# Altium schematic sheet 气压检测.SchDoc
size A2; SheetNumber: 1; SheetTotal: 1
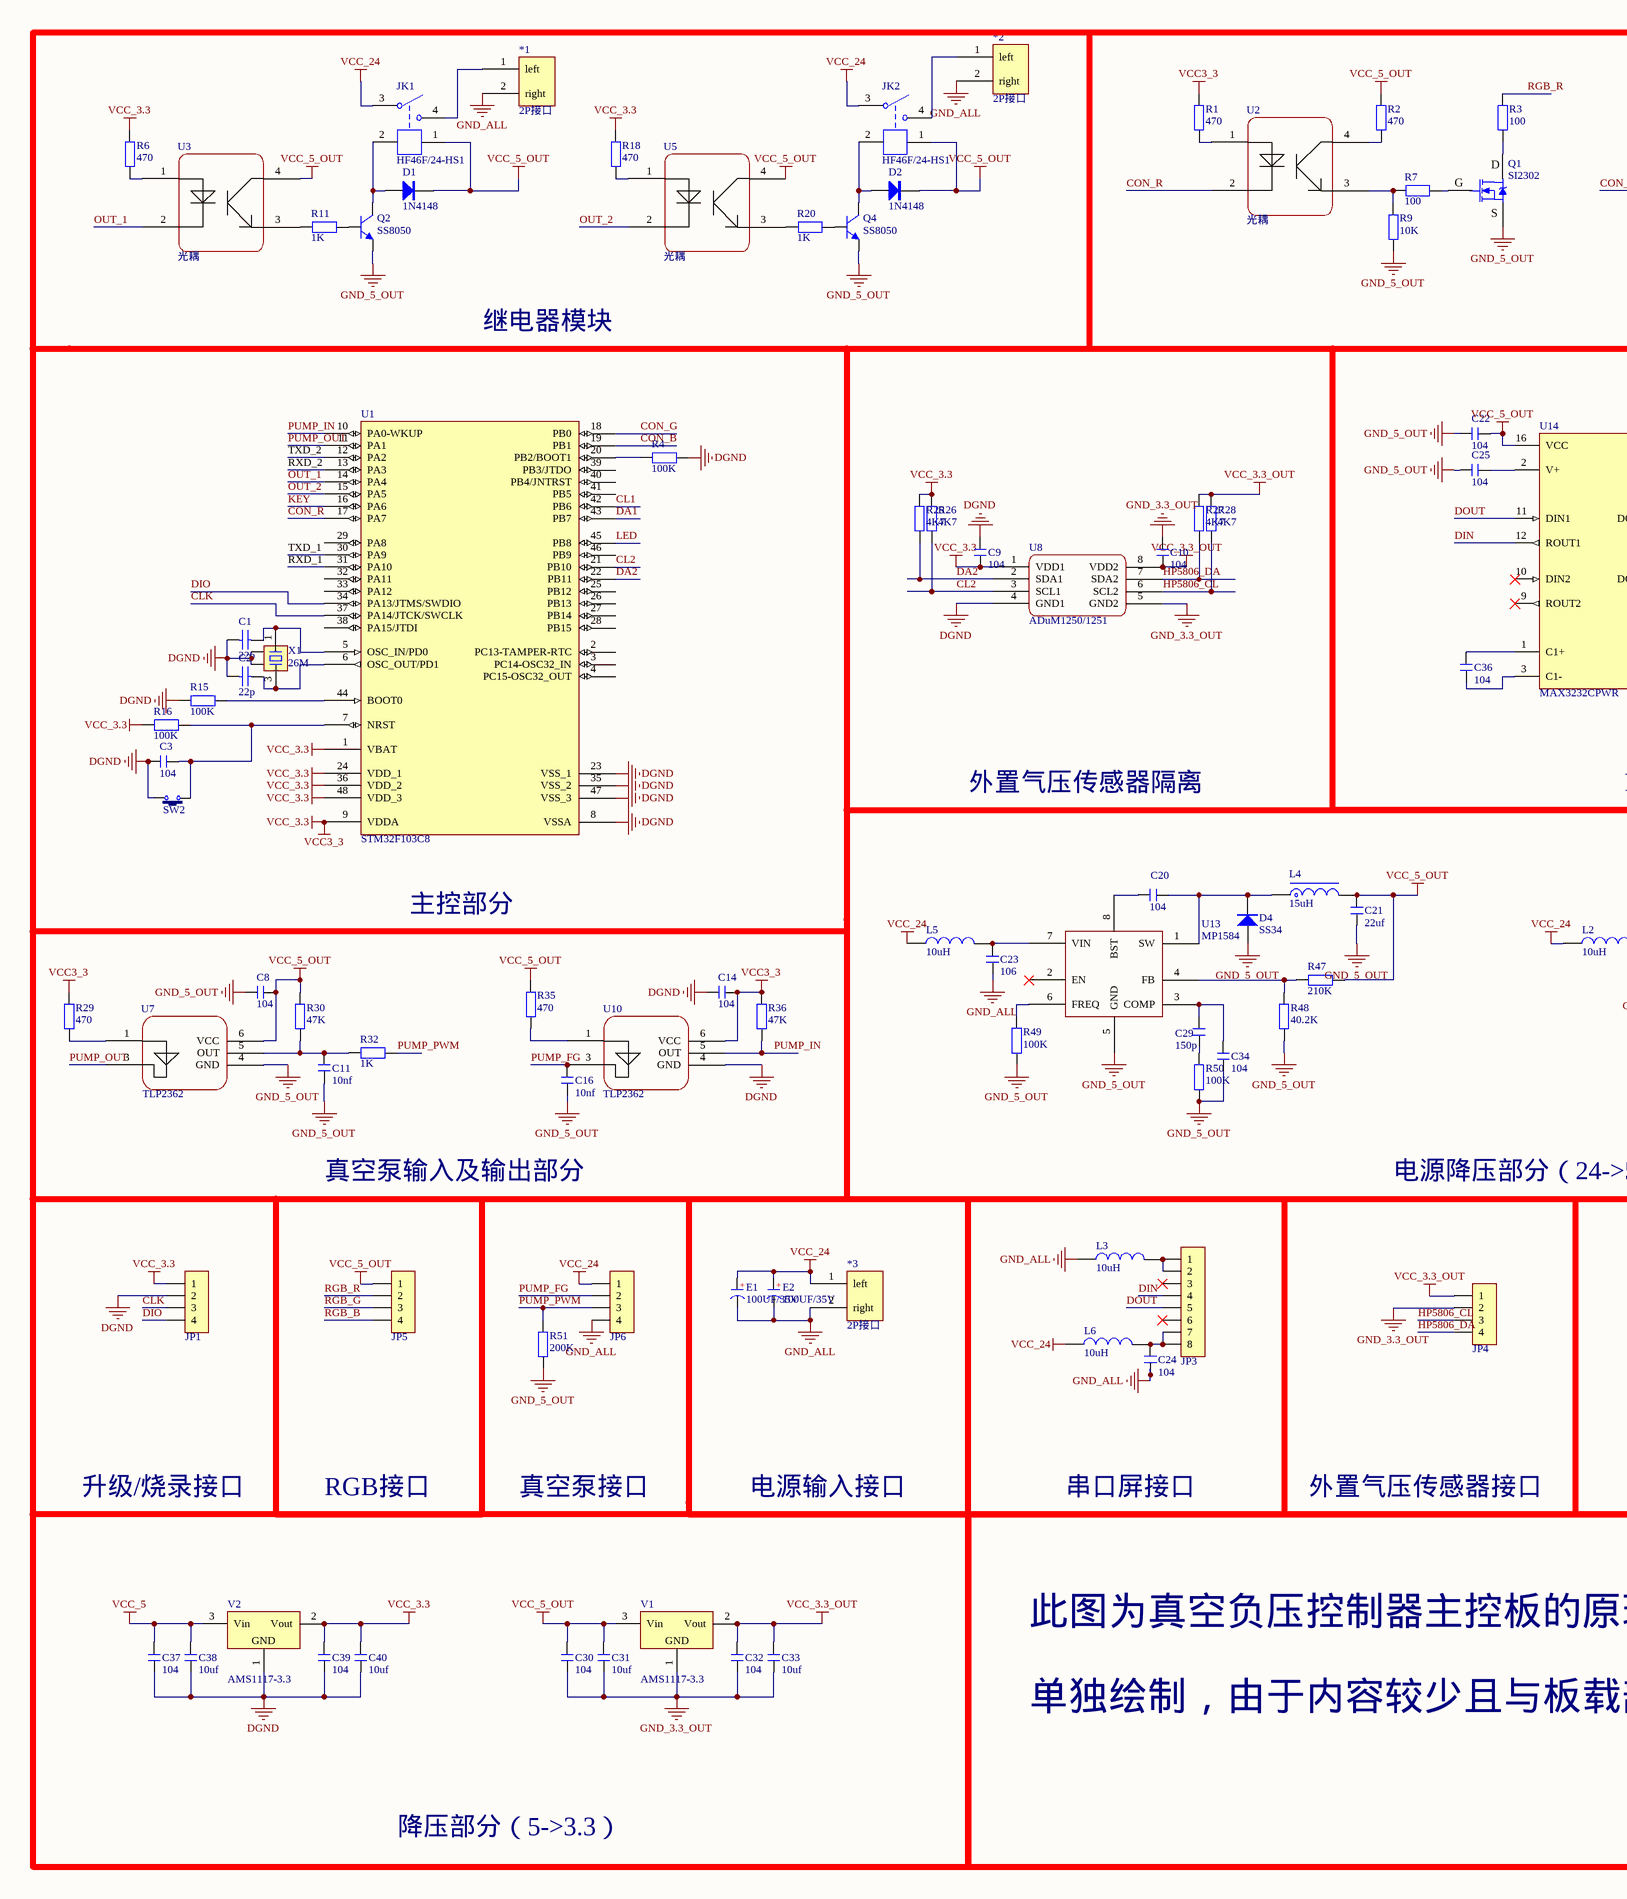
[diagram p0: 气压检测.SchDoc, left]
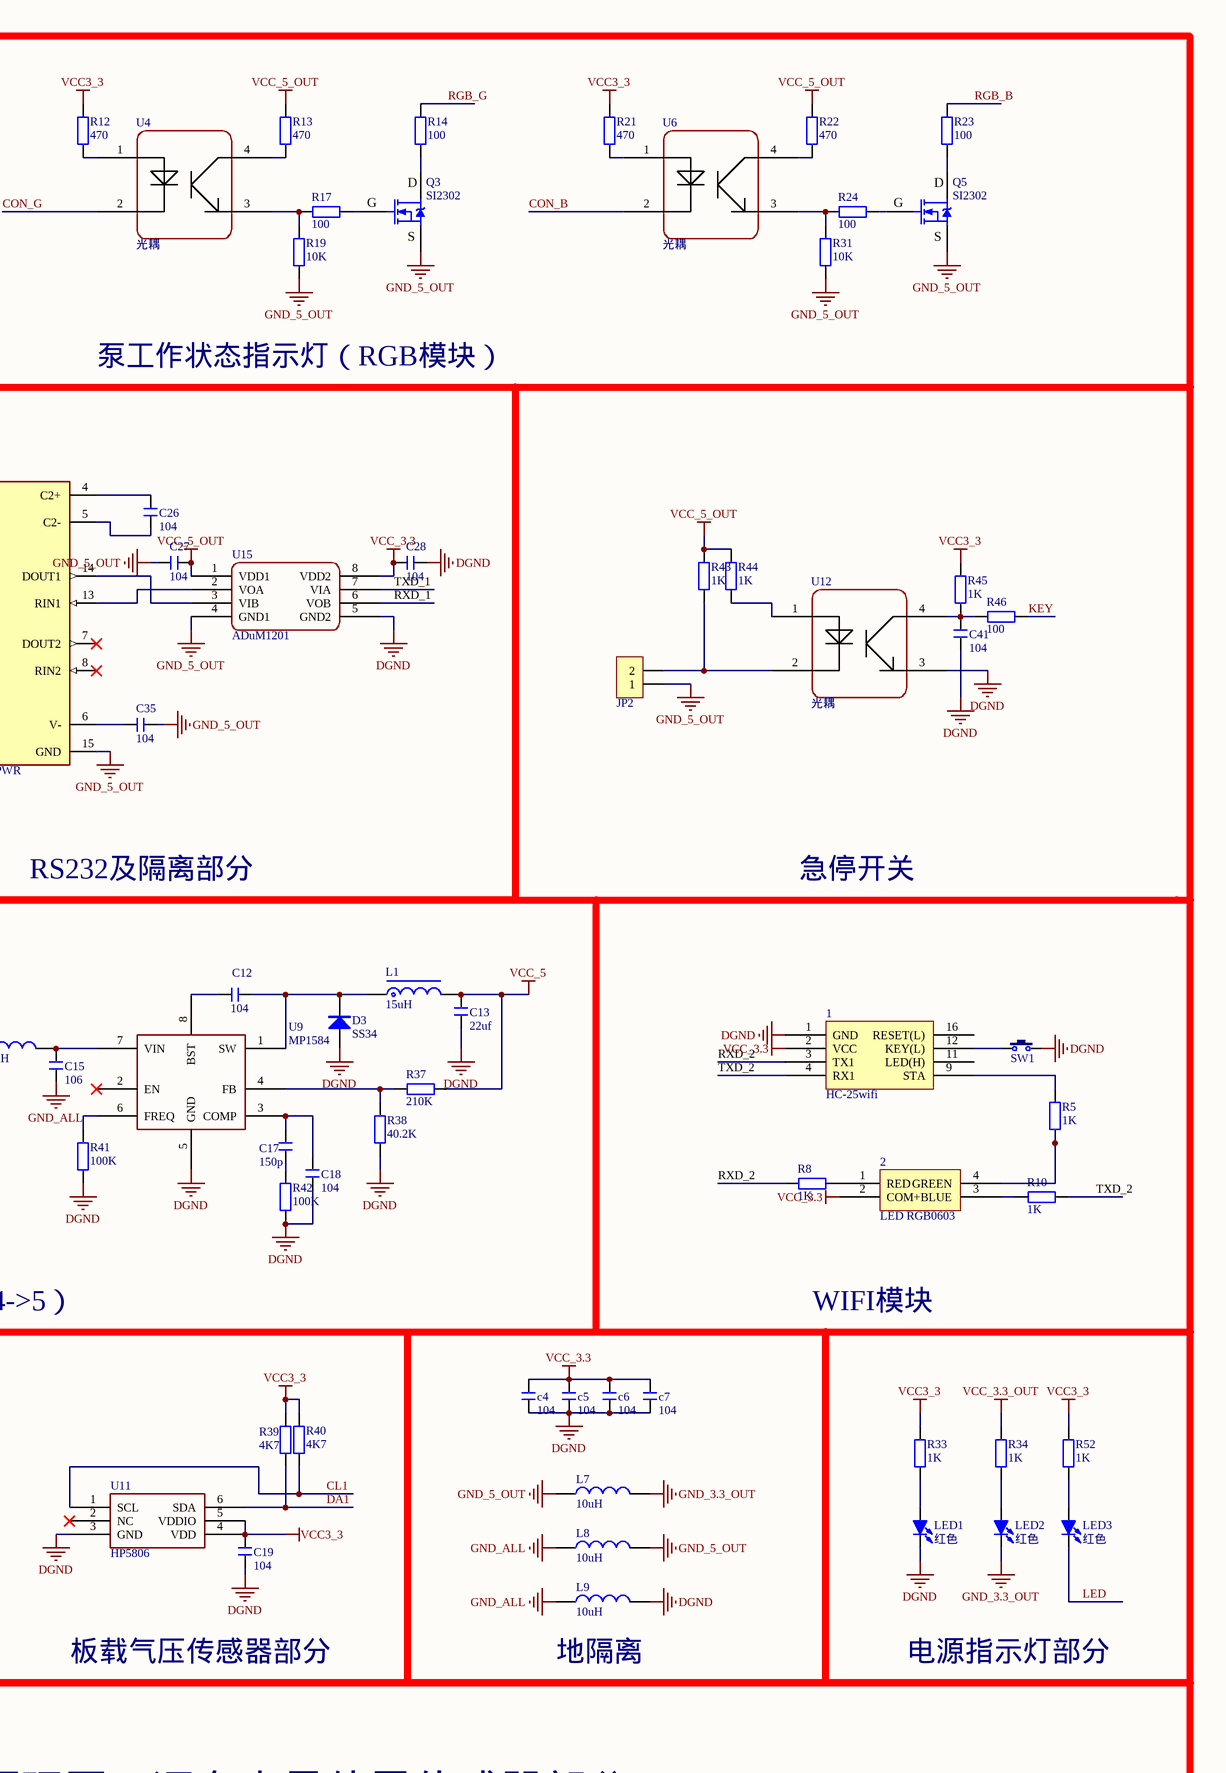
[diagram p1: 气压检测.SchDoc, right]

## Parts
1  HC-25wifi  [HC-25]
2  LED RGB0603  [LED RGB 0603]
*1  2P接口  [KF128_2P]
*2  2P接口  [KF128_2P]
*3  2P接口  [KF128_2P]
C1  22p  [0603-cap]
C2  22p  [0603-cap]
C3  104  [C 0603_L]
c4  104  [C 0603_L]
c5  104  [C 0603_L]
c6  104  [C 0603_L]
c7  104  [C 0603_L]
C8  104  [C 0603_L]
C9  104  [C 0603_L]
C10  104  [C 0603_L]
C11  10nf  [C 0603_L]
C12  104  [C 0603_L]
C13  22uf  [C 1210_L]
C14  104  [C 0603_L]
C15  106  [C 1206_L]
C16  10nf  [C 0603_L]
C17  150p  [C 0603_L]
C18  104  [C 0603_L]
C19  104  [C 0603_L]
C20  104  [C 0603_L]
C21  22uf  [C 1210_L]
C22  104  [C 0603_L]
C23  106  [C 1206_L]
C24  104  [C 0603_L]
C25  104  [C 0603_L]
C26  104  [C 0603_L]
C27  104  [C 0603_L]
C28  104  [C 0603_L]
C29  150p  [C 0603_L]
C30  104  [C 0603_L]
C31  10uf  [C 0805_L]
C32  104  [C 0603_L]
C33  10uf  [C 0805_L]
C34  104  [C 0603_L]
C35  104  [C 0603_L]
C36  104  [C 0603_L]
C37  104  [C 0603_L]
C38  10uf  [C 0805_L]
C39  104  [C 0603_L]
C40  10uf  [C 0805_L]
C41  104  [C 0603_L]
D1  1N4148  [SOD-323]
D2  1N4148  [SOD-323]
D3  SS34  [SMA]
D4  SS34  [SMA]
E1  100UF/35V  [CAP 3.5*8*11.5]
E2  100UF/35V  [CAP 3.5*8*11.5]
JK1  HF46F/24-HS1  [HF46-xx-HS1]
JK2  HF46F/24-HS1  [HF46-xx-HS1]
JP1  HDR-1X4  [XH2.54-LI-4P]  (value not drawn)
JP2  HDR-1X2  [XH2.54-LI-2P]  (value not drawn)
JP3  HDR-1X8  [FPC2.0-8卧贴-带锁扣]  (value not drawn)
JP4  HDR-1X4  [XH2.54-LI-4P]  (value not drawn)
JP5  HDR-1X4  [XH2.54-LI-4P]  (value not drawn)
JP6  HDR-1X4  [XH2.54-LI-4P]  (value not drawn)
L1  15uH  [L 06030]
L2  10uH  [L 1206]
L3  10uH  [L 1206]
L4  15uH  [L 06030]
L5  10uH  [L 1206]
L6  10uH  [L 1206]
L7  10uH  [L 1206]
L8  10uH  [L 1206]
L9  10uH  [L 1206]
LED1  红色  [LED 0603R]
LED2  红色  [LED 0603R]
LED3  红色  [LED 0603R]
Q1  SI2302  [SOT23-3N]
Q2  SS8050  [SOT23-3N]
Q3  SI2302  [SOT23-3N]
Q4  SS8050  [SOT23-3N]
Q5  SI2302  [SOT23-3N]
R1  470  [R 0603_L]
R2  470  [R 0603_L]
R3  100  [R 1206_L]
R4  100K  [R 0603_L]
R5  1K  [R 0603_L]
R6  470  [R 0603_L]
R7  100  [R 0603_L]
R8  1K  [R 0603_L]
R9  10K  [R 0603_L]
R10  1K  [R 0603_L]
R11  1K  [R 0603_L]
R12  470  [R 0603_L]
R13  470  [R 0603_L]
R14  100  [R 1206_L]
R15  100K  [R 0603_L]
R16  100K  [R 0603_L]
R17  100  [R 0603_L]
R18  470  [R 0603_L]
R19  10K  [R 0603_L]
R20  1K  [R 0603_L]
R21  470  [R 0603_L]
R22  470  [R 0603_L]
R23  100  [R 1206_L]
R24  100  [R 0603_L]
R25  4K7  [R 0603_L]
R26  4K7  [R 0603_L]
R27  4K7  [R 0603_L]
R28  4K7  [R 0603_L]
R29  470  [R 0603_L]
R30  47K  [R 0603_L]
R31  10K  [R 0603_L]
R32  1K  [R 0603_L]
R33  1K  [R 0603_L]
R34  1K  [R 0603_L]
R35  470  [R 0603_L]
R36  47K  [R 0603_L]
R37  210K  [R 0603_L]
R38  40.2K  [R 0603_L]
R39  4K7  [R 0603_L]
R40  4K7  [R 0603_L]
R41  100K  [R 0603_L]
R42  100K  [R 0603_L]
R43  1K  [R 0603_L]
R44  1K  [R 0603_L]
R45  1K  [R 0603_L]
R46  100  [R 0603_L]
R47  210K  [R 0603_L]
R48  40.2K  [R 0603_L]
R49  100K  [R 0603_L]
R50  100K  [R 0603_L]
R51  200K  [R 0603_L]
R52  1K  [R 0603_L]
SW1  3x6x5  [TSW SMD-3*4*2]  (value not drawn)
SW2  3x6x5  [TSW SMD-3*4*2]  (value not drawn)
U1  STM32F103C8  [LQFP48 7X7_N]
U2  光耦  [SMD-4]
U3  光耦  [SMD-4]
U4  光耦  [SMD-4]
U5  光耦  [SMD-4]
U6  光耦  [SMD-4]
U7  TLP2362  [SO6]
U8  ADuM1250/1251  [SOP8_L]
U9  MP1584  [SOP8_N]
U10  TLP2362  [SO6]
U11  HP5806  [HP5806]
U12  光耦  [SMD-4]
U13  MP1584  [SOP8_N]
U14  MAX3232CPWR  [FP-PW0016A-IPC_B]
U15  ADuM1201  [SOP8_N]
V1  AMS1117-3.3  [SOT223_N]
V2  AMS1117-3.3  [SOT223_N]
X1  26M  [OSC 3225-4P]

## Nets
DGND: 1.1(GND) C1.2 C2.2 C3.1 c4.1 c5.1 c6.1 c7.1 C9.2 C13.1 C14.2 C18.1 C19.2 C28.2 C37.1 C38.1 C39.1 C40.1 C41.2 D3.1(A) JP1.2 L9.2 LED1.2(K) R4.1 R15.1 R38.2 R41.1 R42.2 SW1.2 SW2.2 U1.8(VSSA) U1.23(VSS_1) U1.35(VSS_2) U1.47(VSS_3) U8.4(GND1) U9.5(GND) U10.4(GND) U11.3(GND) U12.3 U15.5(GND2) V2.1(GND) X1.2 X1.4
GND_3.3_OUT: C10.2 C30.1 C31.1 C32.1 C33.1 JP4.2 L7.2 LED2.2(K) U8.5(GND2) V1.1(GND)
GND_5_OUT: C8.2 C11.2 C16.2 C21.1 C22.2 C25.2 C27.2 C34.1 C35.2 D4.1(A) JP2.1 L7.1 L8.2 Q1.2(S) Q2.2(E) Q3.2(S) Q4.2(E) Q5.2(S) R9.1 R19.1 R31.1 R48.2 R49.1 R50.2 R51.1 U7.4(GND) U13.5(GND) U14.15(GND) U15.4(GND1)
GND_ALL: *1.2(right) *2.2(right) *3.2(right) C15.1 C23.1 C24.2 E1.2(K) E2.2(K) JP6.4 L3.1 L8.1 L9.1
VCC3_3: 1.2(VCC) 2.2(COM+) c4.2 c5.2 c6.2 c7.2 C9.1 C14.1 C19.1 C28.1 C39.2 C40.2 JP1.1 R1.2 R6.2 R12.2 R16.1 R18.2 R21.2 R25.2 R26.2 R29.2 R33.1 R36.2 R39.1 R40.1 R45.2 R52.1 U1.1(VBAT) U1.9(VDDA) U1.24(VDD_1) U1.36(VDD_2) U1.48(VDD_3) U8.1(VDD1) U10.6(VCC) U11.4(VDD) U11.5(VDDIO) U15.8(VDD2) V2.2(Vout)  [also labelled VCC_3.3]
VCC_3.3_OUT: C10.1 C32.2 C33.2 JP4.1 R27.2 R28.2 R34.1 U8.8(VDD2) V1.2(Vout)
VCC_5: C13.2 C37.2 C38.2 L1.2 R37.2 V2.3(Vin)
VCC_5_OUT: C8.1 C21.2 C22.1 C27.1 C30.2 C31.2 D1.2(K) D2.2(K) JK1.1 JK2.1 JP5.1 L4.2 R2.2 R13.2 R22.2 R30.2 R35.2 R43.2 R44.2 R47.2 U3.4 U5.4 U7.6(VCC) U14.16(VCC) U15.1(VDD1) V1.3(Vin)
VCC_24: *3.1(left) E1.1(A) E2.1(A) JK1.3 JK2.3 JP6.1 L2.1 L5.1 L6.1
CL1: R40.2 U1.42(PB6) U11.1(SCL)
CL2: R26.1 U1.21(PB10) U8.3(SCL1)
CLK: JP1.3 U1.37(PA14/JTCK/SWCLK)
CON_B: U1.19(PB1) U6.2
CON_G: U1.18(PB0) U4.2
CON_R: U1.17(PA7) U2.2
DA1: R39.2 U1.43(PB7) U11.6(SDA)
DA2: R25.1 U1.22(PB11) U8.2(SDA1)
DIN: JP3.4 U14.12(ROUT1)
DIO: JP1.4 U1.34(PA13/JTMS/SWDIO)
DOUT: JP3.5 U14.11(DIN1)
HP5806_CL: JP4.3 R28.1 U8.6(SCL2)
HP5806_DA: JP4.4 R27.1 U8.7(SDA2)
KEY: R46.1 U1.16(PA6)
LED: LED3.2(K) U1.45(PB8)
OUT_1: U1.14(PA4) U3.2
OUT_2: U1.15(PA5) U5.2
PUMP_FG: C16.1 JP6.2 U10.3
PUMP_IN: R36.1 U1.10(PA0-WKUP) U10.5(OUT)
PUMP_OUT: U1.11(PA1) U7.3
PUMP_PWM: JP6.3 R32.1 R51.2
RGB_B: JP5.4 R23.2
RGB_G: JP5.3 R14.2
RGB_R: JP5.2 R3.2
RXD_1: U1.31(PA10) U15.6(VOB)
RXD_2: 1.3(TX1) R8.1 U1.13(PA3)
TXD_1: U1.30(PA9) U15.7(VIA)
TXD_2: 1.4(RX1) R10.2 U1.12(PA2)
Net1_9: 1.9(STA) R5.1
Net1_12: 1.12(KEY(L)) SW1.1
Net2_1: 2.1(RED) R8.2
Net2_3: 2.3(BLUE) R10.1
Net2_4: 2.4(GREEN) R5.2
Net*1_1: *1.1(left) JK1.4
Net*2_1: *2.1(left) JK2.4
NetC1_1: C1.1 U1.5(OSC_IN/PD0) X1.1
NetC2_1: C2.1 U1.6(OSC_OUT/PD1) X1.3
NetC3_2: C3.2 R16.2 SW2.1 U1.7(NRST)
NetC11_1: C11.1 R30.1 R32.2 U7.5(OUT)
NetC12_1: C12.1 D3.2(K) L1.1 U9.1(SW)
NetC12_2: C12.2 U9.8(BST)
NetC15_2: C15.2 L2.2 U9.7(VIN)
NetC17_1: C17.1 R42.1
NetC17_2: C17.2 C18.2 U9.3(COMP)
NetC20_1: C20.1 D4.2(K) L4.1 U13.1(SW)
NetC20_2: C20.2 U13.8(BST)
NetC23_2: C23.2 L5.2 U13.7(VIN)
NetC24_1: C24.1 JP3.7 JP3.8 L6.2
NetC25_1: C25.1 U14.2(V+)
NetC26_1: C26.1 U14.4(C2+)
NetC26_2: C26.2 U14.5(C2-)
NetC29_1: C29.1 R50.1
NetC29_2: C29.2 C34.2 U13.3(COMP)
NetC35_1: C35.1 U14.6(V-)
NetC36_1: C36.1 U14.1(C1+)
NetC36_2: C36.2 U14.3(C1-)
NetC41_1: C41.1 R45.1 R46.2 U12.4
NetD1_1: D1.1(A) JK1.2 Q2.3(C)
NetD2_1: D2.1(A) JK2.2 Q4.3(C)
NetJP2_2: JP2.2 R43.1 U12.2
NetJP3_1: JP3.1 JP3.2 L3.2
NetLED1_1: LED1.1(A) R33.2
NetLED2_1: LED2.1(A) R34.2
NetLED3_1: LED3.1(A) R52.2
NetQ1_1: Q1.1(G) R7.1
NetQ1_3: Q1.3(D) R3.1
NetQ2_1: Q2.1(B) R11.2
NetQ3_1: Q3.1(G) R17.1
NetQ3_3: Q3.3(D) R14.1
NetQ4_1: Q4.1(B) R20.2
NetQ5_1: Q5.1(G) R24.1
NetQ5_3: Q5.3(D) R23.1
NetR1_1: R1.1 U2.1
NetR2_1: R2.1 U2.4
NetR4_2: R4.2 U1.20(PB2/BOOT1)
NetR6_1: R6.1 U3.1
NetR7_2: R7.2 R9.2 U2.3
NetR11_1: R11.1 U3.3
NetR12_1: R12.1 U4.1
NetR13_1: R13.1 U4.4
NetR15_2: R15.2 U1.44(BOOT0)
NetR17_2: R17.2 R19.2 U4.3
NetR18_1: R18.1 U5.1
NetR20_1: R20.1 U5.3
NetR21_1: R21.1 U6.1
NetR22_1: R22.1 U6.4
NetR24_2: R24.2 R31.2 U6.3
NetR29_1: R29.1 U7.1
NetR35_1: R35.1 U10.1
NetR37_1: R37.1 R38.1 U9.4(FB)
NetR41_2: R41.2 U9.6(FREQ)
NetR44_1: R44.1 U12.1
NetR47_1: R47.1 R48.1 U13.4(FB)
NetR49_2: R49.2 U13.6(FREQ)
NetU14_13: U14.13(RIN1) U15.2(VOA)
NetU14_14: U14.14(DOUT1) U15.3(VIB)

Not connected (* = marked no-connect by the designer): 1 11(LED(H)) 16(RESET(L)); JP3 3* 6*; U1 2(PC13-TAMPER-RTC) 3(PC14-OSC32_IN) 4(PC15-OSC32_OUT) 25(PB12) 26(PB13) 27(PB14) 28(PB15) 29(PA8) 32(PA11) 33(PA12) 38(PA15/JTDI) 39(PB3/JTDO) 40(PB4/JNTRST) 41(PB5) 46(PB9); U9 2(EN)*; U11 2(NC)*; U13 2(EN)*; U14 7(DOUT2)* 8(RIN2)* 9(ROUT2)* 10(DIN2)*

## Notes on the sheet
- 继电器模块
- 泵工作状态指示灯（RGB模块）
- 外置气压传感器隔离
- RS232及隔离部分
- 急停开关
- 主控部分
- 真空泵输入及输出部分
- 电源降压部分（24->5）
- WIFI模块
- 升级/烧录接口
- RGB接口
- 真空泵接口
- 电源输入接口
- 串口屏接口
- 外置气压传感器接口
- 板载气压传感器部分
- (near L9) 地隔离
- 电源指示灯部分
- 此图为真空负压控制器主控板的原理图，还有少量外置传感器部分
- 单独绘制，由于内容较少且与板载部分区别不大，故不单独放出。
- 降压部分（5->3.3）
- (in symbol C-CAP) +

## Library data of the parts
1 = HC-25wifi: HC-25WIFI无线模块
C1 C2 = Cap1: value: 22p
C3 c4-c7 C8-C41 = C: 无极性贴片电容; 版权归属: 源创客; BOM名称: 无极性贴片电容; 学习资源: www.ooocke.com
D1 D2 = 1N4148: 高速开关二极管; 版权归属: 源创客; BOM名称: 高速开关二极管; 学习资源: www.ooocke.com
D3 D4 = SS210: 肖特基二极管; 版权归属: 源创客; BOM名称: 肖特基二极管; 学习资源: www.ooocke.com
E1 E2 = C-CAP: 直插电解电容; 版权归属: 源创客; BOM名称: 直插电解电容; 学习资源: www.ooocke.com
JK1 JK2 = HF46F/24-HS1: 24V一组常开; BOM名称: 24V继电器; 版权归属: 源创客; 学习资源: www.ooocke.com
JP1 JP4-JP6 = Header 4: 4P接插件; 版权归属: 源创客; BOM名称: 4P接插件; 学习资源: www.ooocke.com
JP2 = Header 2: 2P接插件; 版权归属: 源创客; BOM名称: 2P接插件; 学习资源: www.ooocke.com
JP3 = Header 8: 8P接插件; 版权归属: 源创客; BOM名称: 8P接插件; 学习资源: www.ooocke.com
L1 L4 = L-CD: 贴片功率电感; BOM名称: 功率电感; 版权归属: 源创客; 学习资源: www.ooocke.com
L2 L3 L5-L9 = L: 小功率贴片电感; 版权归属: 源创客; BOM名称: 小功率贴片电感; 学习资源: www.ooocke.com
LED1-LED3 = LED-SMD: 贴片LED; 版权归属: 源创客; BOM名称: 贴片LED; 学习资源: www.ooocke.com
Q1 Q3 Q5 = SI2302: N沟道场效应管; 版权归属: 源创客; BOM名称: N沟道场效应管; 学习资源: www.ooocke.com
Q2 Q4 = 8050-SMD: 高频放大-NPN型; 版权归属: 源创客; 属性: 40V 1.5A 1W 100MHZ; BOM名称: 高频放大-NPN型; 学习资源: www.ooocke.com
R1-R52 = R: 贴片电阻; 版权归属: 源创客; BOM名称: 贴片电阻; 学习资源: www.ooocke.com
SW1 SW2 = TSW 3x6: 3x6轻触开关; 版权归属: 源创客; BOM名称: 3x6轻触开关; 学习资源: www.ooocke.com
U1 = STM32F103C8: Flaah:64/RAM:20/IO:36; BOM名称: 32位STM单片机; 版权归属: 源创客; 学习资源: www.ooocke.com
U2-U6 U12 = 光耦: 低速单通道普通光耦
U7 U10 = TLP2362: 高速光耦（TOSHIBA)2.7-5.5V
U9 U13 = MP1584: DC降压芯片
U11 = HP5806: I2C气压传感器
U14 = CMP-0299-01731-3: IC TRANSCEIVER FULL 2/2 16TSSOP; Simplex/Duplex: Full Duplex; Nominal Supply Current: 1mA; Max Supply Voltage: 5.5V; Operating Supply Voltage: 5V; Number of Drivers: 2; Data Rate: 250Kbps; Supply Type: Single; Number of Transceivers: 1; Min Supply Voltage: 3V; Height: 1mm; Lead Free: Lead Free; REACH SVHC: No SVHC; Logic Function: Transceiver; Number of Pins: 16; Termination: SMD/SMT; Mount: Surface Mount; Package Quantity: 1; Operating Supply Current: 1mA; Max Operating Temperature: 85°C; Length: 5mm; Radiation Hardening: No; Case/Package: TSSOP; Min Operating Temperature: -40°C; Number of Channels: 2; Number of Receivers: 2; Width: 4.4mm; Weight: 0.002183oz; Packaging: Tape and Reel; Number of Transmitters: 2
U15 = ADuM1201: 通用隔离芯片
V1 V2 = AMS1117: 三端稳压芯片; BOM名称: 稳压芯片; 版权归属: 源创客; 学习资源: www.ooocke.com
X1 = XTAL-4P: 4脚无源晶振; 版权归属: 源创客; BOM名称: 4脚无源晶振; 学习资源: www.ooocke.com